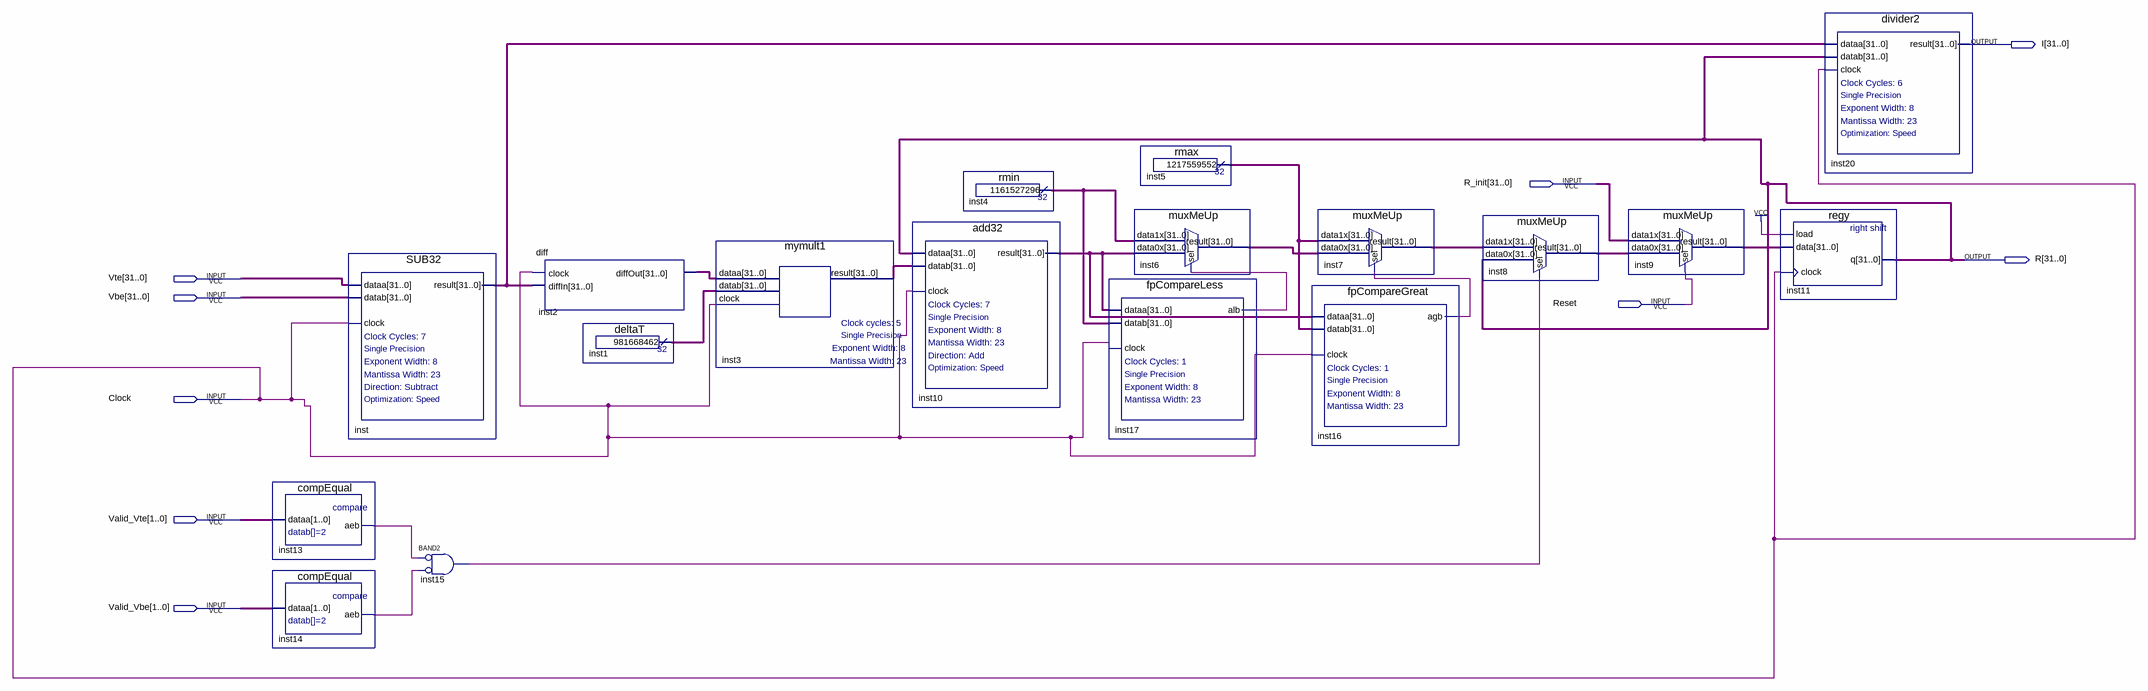
[diagram p0: schematic sheet]
// Quartus schematic memristor.bdf as structural Verilog: 18 symbols, 9 pins
module memristor (
  input  [31:0] R_init,
  input  [31:0] Vte,
  input  [31:0] Vbe,
  input  Reset,
  input  Clock,
  input  [1:0] Valid_Vte,
  input  [1:0] Valid_Vbe,
  output [31:0] I,
  output [31:0] R
);

  wire inst13_aeb, inst14_aeb, inst15_out, inst16_agb, inst17_alb;
  wire [31:0] inst1_result, inst2_diffout, inst3_result, inst4_result, inst5_result, inst6_result,
       inst7_result, inst8_result, inst9_result, inst10_result, inst_result;

  compEqual inst13 (.dataa(Valid_Vte), .aeb(inst13_aeb));
  compEqual inst14 (.dataa(Valid_Vbe), .aeb(inst14_aeb));
  SUB32 inst (.dataa(Vte), .datab(Vbe), .clock(Clock), .result(inst_result));
  and inst15 (inst15_out, ~inst13_aeb, ~inst14_aeb);  // BAND2
  diff inst2 (.clock(Clock), .diffIn(inst_result), .diffOut(inst2_diffout));
  deltaT inst1 (.result(inst1_result));
  mymult1 inst3 (.dataa(inst2_diffout), .datab(inst1_result), .clock(Clock), .result(inst3_result));
  add32 inst10 (.dataa(R), .datab(inst3_result), .clock(Clock), .result(inst10_result));
  rmin inst4 (.result(inst4_result));
  rmax inst5 (.result(inst5_result));
  muxMeUp inst6 (.data1x(inst4_result), .data0x(inst10_result), .sel(inst17_alb), .result(inst6_result));
  fpCompareLess inst17 (.dataa(inst10_result), .datab(inst4_result), .clock(Clock), .alb(inst17_alb));
  muxMeUp inst7 (.data1x(inst5_result), .data0x(inst6_result), .sel(inst16_agb), .result(inst7_result));
  fpCompareGreat inst16 (.dataa(inst10_result), .datab(inst5_result), .clock(Clock), .agb(inst16_agb));
  muxMeUp inst8 (.data1x(inst7_result), .data0x(R), .sel(inst15_out), .result(inst8_result));
  muxMeUp inst9 (.data1x(R_init), .data0x(inst8_result), .sel(Reset), .result(inst9_result));
  regy inst11 (.load(1'b1), .data(inst9_result), .clock(Clock), .q(R));
  divider2 inst20 (.dataa(inst_result), .datab(R), .clock(Clock), .result(I));
endmodule
